# Altium schematic sheet CarrierMezzanineConnectors.SchDoc
size A3; SheetNumber: 2; SheetTotal: 3
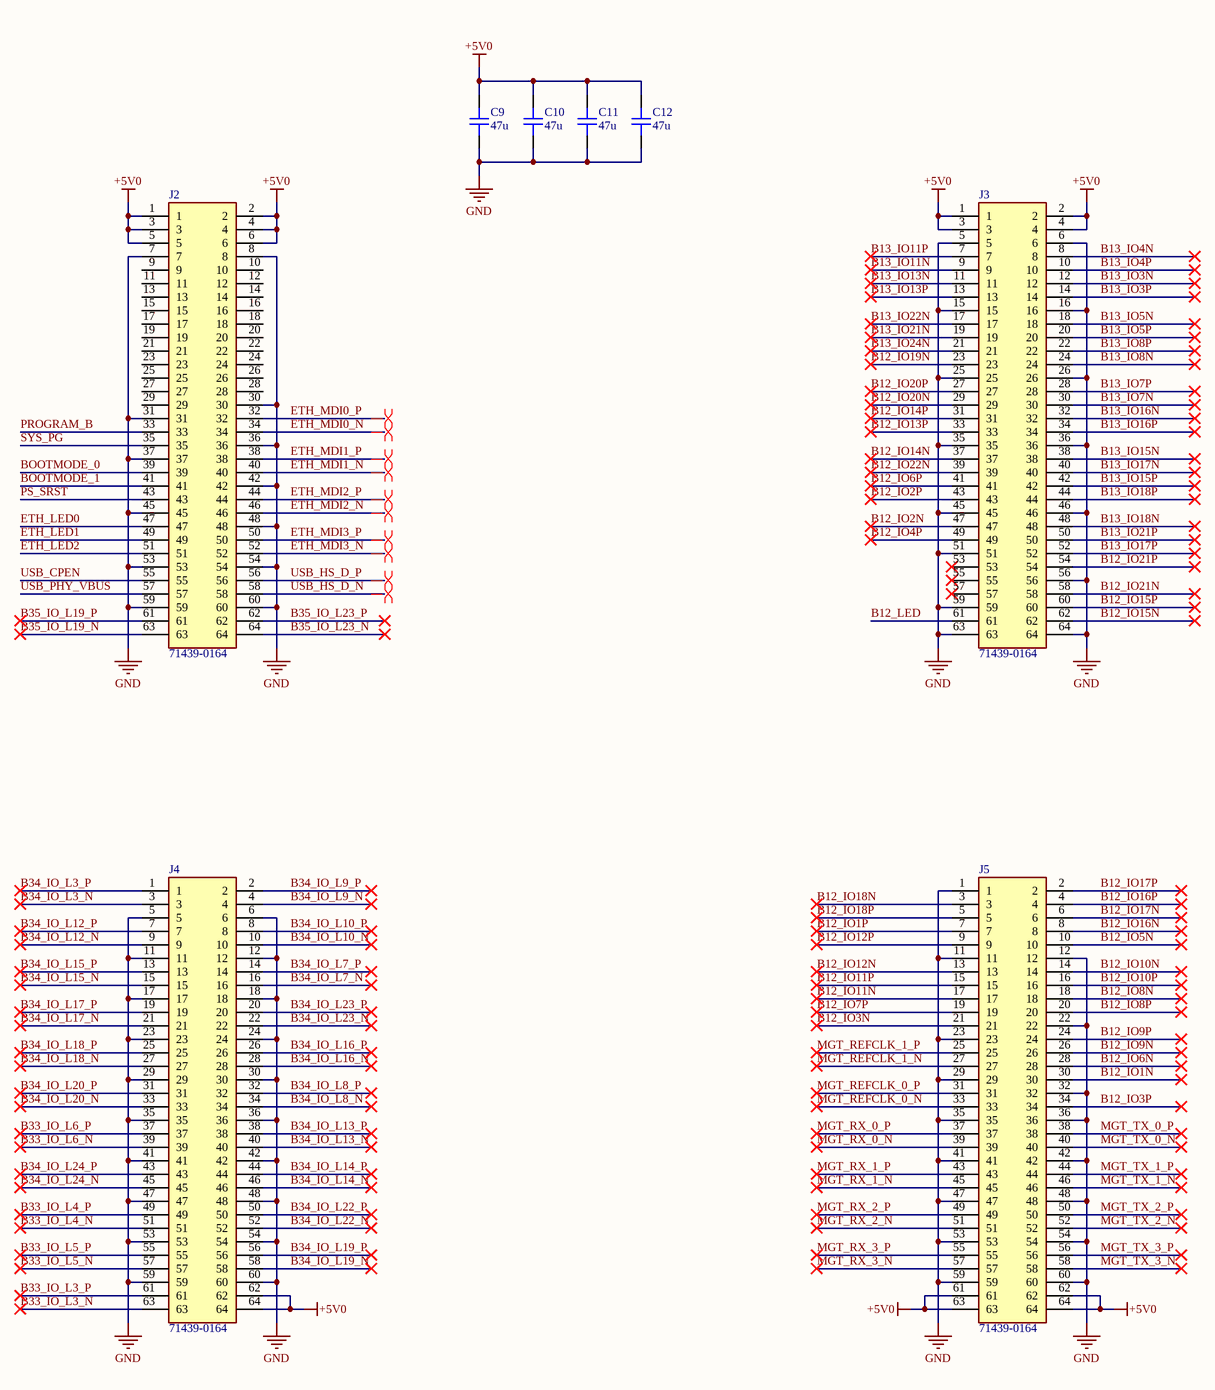
[diagram p0: CarrierMezzanineConnectors.SchDoc]

## Parts
C9  47u  [CAP_1210]
C10  47u  [CAP_1210]
C11  47u  [CAP_1210]
C12  47u  [CAP_1210]
J2  71439-0164  [714390164]
J3  71439-0164  [714390164]
J4  71439-0164  [714390164]
J5  71439-0164  [714390164]

## Nets
+5V0: C9.2 C10.2 C11.2 C12.2 J2.1 J2.2 J2.3 J2.4 J2.5 J2.6 J3.1 J3.2 J3.3 J3.4 J4.62 J4.64 J5.61 J5.62 J5.63 J5.64
GND: C9.1 C10.1 C11.1 C12.1 J2.7 J2.8 J2.30 J2.31 J2.36 J2.37 J2.42 J2.45 J2.48 J2.53 J2.54 J2.59 J2.60 J3.5 J3.6 J3.15 J3.16 J3.25 J3.26 J3.35 J3.36 J3.45 J3.46 J3.51 J3.56 J3.59 J3.63 J3.64 J4.5 J4.6 J4.11 J4.12 J4.17 J4.18 J4.23 J4.24 J4.29 J4.30 J4.35 J4.36 J4.41 J4.42 J4.47 J4.48 J4.53 J4.54 J4.59 J4.60 J5.1 J5.11 J5.12 J5.22 J5.23 J5.29 J5.32 J5.35 J5.36 J5.41 J5.42 J5.47 J5.48 J5.53 J5.54 J5.59 J5.60
B12_IO1N: J5.30
B12_IO1P: J5.7
B12_IO2N: J3.47
B12_IO2P: J3.43
B12_IO3N: J5.21
B12_IO3P: J5.34
B12_IO4P: J3.49
B12_IO5N: J5.10
B12_IO6N: J5.28
B12_IO6P: J3.41
B12_IO7P: J5.19
B12_IO8N: J5.18
B12_IO8P: J5.20
B12_IO9N: J5.26
B12_IO9P: J5.24
B12_IO10N: J5.14
B12_IO10P: J5.16
B12_IO11N: J5.17
B12_IO11P: J5.15
B12_IO12N: J5.13
B12_IO12P: J5.9
B12_IO13P: J3.33
B12_IO14N: J3.37
B12_IO14P: J3.31
B12_IO15N: J3.62
B12_IO15P: J3.60
B12_IO16N: J5.8
B12_IO16P: J5.4
B12_IO17N: J5.6
B12_IO17P: J5.2
B12_IO18N: J5.3
B12_IO18P: J5.5
B12_IO19N: J3.23
B12_IO20N: J3.29
B12_IO20P: J3.27
B12_IO21N: J3.58
B12_IO21P: J3.54
B12_IO22N: J3.39
B12_LED: J3.61
B13_IO3N: J3.12
B13_IO3P: J3.14
B13_IO4N: J3.8
B13_IO4P: J3.10
B13_IO5N: J3.18
B13_IO5P: J3.20
B13_IO7N: J3.30
B13_IO7P: J3.28
B13_IO8N: J3.24
B13_IO8P: J3.22
B13_IO11N: J3.9
B13_IO11P: J3.7
B13_IO13N: J3.11
B13_IO13P: J3.13
B13_IO15N: J3.38
B13_IO15P: J3.42
B13_IO16N: J3.32
B13_IO16P: J3.34
B13_IO17N: J3.40
B13_IO17P: J3.52
B13_IO18N: J3.48
B13_IO18P: J3.44
B13_IO21N: J3.19
B13_IO21P: J3.50
B13_IO22N: J3.17
B13_IO24N: J3.21
B33_IO_L3_N: J4.63
B33_IO_L3_P: J4.61
B33_IO_L4_N: J4.51
B33_IO_L4_P: J4.49
B33_IO_L5_N: J4.57
B33_IO_L5_P: J4.55
B33_IO_L6_N: J4.39
B33_IO_L6_P: J4.37
B34_IO_L3_N: J4.3
B34_IO_L3_P: J4.1
B34_IO_L7_N: J4.16
B34_IO_L7_P: J4.14
B34_IO_L8_N: J4.34
B34_IO_L8_P: J4.32
B34_IO_L9_N: J4.4
B34_IO_L9_P: J4.2
B34_IO_L10_N: J4.10
B34_IO_L10_P: J4.8
B34_IO_L12_N: J4.9
B34_IO_L12_P: J4.7
B34_IO_L13_N: J4.40
B34_IO_L13_P: J4.38
B34_IO_L14_N: J4.46
B34_IO_L14_P: J4.44
B34_IO_L15_N: J4.15
B34_IO_L15_P: J4.13
B34_IO_L16_N: J4.28
B34_IO_L16_P: J4.26
B34_IO_L17_N: J4.21
B34_IO_L17_P: J4.19
B34_IO_L18_N: J4.27
B34_IO_L18_P: J4.25
B34_IO_L19_N: J4.58
B34_IO_L19_P: J4.56
B34_IO_L20_N: J4.33
B34_IO_L20_P: J4.31
B34_IO_L22_N: J4.52
B34_IO_L22_P: J4.50
B34_IO_L23_N: J4.22
B34_IO_L23_P: J4.20
B34_IO_L24_N: J4.45
B34_IO_L24_P: J4.43
B35_IO_L19_N: J2.63
B35_IO_L19_P: J2.61
B35_IO_L23_N: J2.64
B35_IO_L23_P: J2.62
BOOTMODE_0: J2.39
BOOTMODE_1: J2.41
ETH_LED0: J2.47
ETH_LED1: J2.49
ETH_LED2: J2.51
ETH_MDI0_N: J2.34
ETH_MDI0_P: J2.32
ETH_MDI1_N: J2.40
ETH_MDI1_P: J2.38
ETH_MDI2_N: J2.46
ETH_MDI2_P: J2.44
ETH_MDI3_N: J2.52
ETH_MDI3_P: J2.50
MGT_REFCLK_0_N: J5.33
MGT_REFCLK_0_P: J5.31
MGT_REFCLK_1_N: J5.27
MGT_REFCLK_1_P: J5.25
MGT_RX_0_N: J5.39
MGT_RX_0_P: J5.37
MGT_RX_1_N: J5.45
MGT_RX_1_P: J5.43
MGT_RX_2_N: J5.51
MGT_RX_2_P: J5.49
MGT_RX_3_N: J5.57
MGT_RX_3_P: J5.55
MGT_TX_0_N: J5.40
MGT_TX_0_P: J5.38
MGT_TX_1_N: J5.46
MGT_TX_1_P: J5.44
MGT_TX_2_N: J5.52
MGT_TX_2_P: J5.50
MGT_TX_3_N: J5.58
MGT_TX_3_P: J5.56
PROGRAM_B: J2.33
PS_SRST: J2.43
SYS_PG: J2.35
USB_CPEN: J2.55
USB_HS_D_N: J2.58
USB_HS_D_P: J2.56
USB_PHY_VBUS: J2.57

Not connected (* = marked no-connect by the designer): J2 9 10 11 12 13 14 15 16 17 18 19 20 21 22 23 24 25 26 27 28 29; J3 53* 55* 57*

## Layout directives
differential pair: ETH_MDI0_N, ETH_MDI0_P, ETH_MDI1_N, ETH_MDI1_P, ETH_MDI2_N, ETH_MDI2_P, ETH_MDI3_N, ETH_MDI3_P, USB_HS_D_N, USB_HS_D_P

## Library data of the parts
C9-C12 = CAP_1210: Capacitor SMD 1210; Manufacturer: *; Manufacturer Part Number: *; Distributor Link: *; LCSC: *; Rating: *; Dielectric: *
J2-J5 = 71439-0164: Board to Board & Mezzanine Connectors PMC RECEPTACLE SMT; Manufacturer_Name: Molex; Datasheet Link: https://componentsearchengine.com/Datasheets/1/71439-0164.pdf; Height: 5.3mm; Manufacturer_Part_Number: 71439-0164; Mouser Part Number: 538-71439-0164; Mouser Price/Stock: https://www.mouser.co.uk/ProductDetail/Molex/71439-0164?qs=X1mjqRbeMc7uGUsAO8ttVw%3D%3D